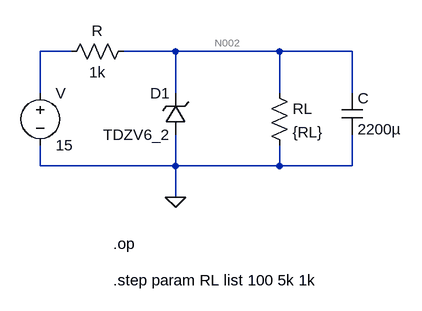
[diagram p0: schematic Draft3.asc]
Draft3.asc, the LTspice schematic file:
Version 4
SHEET 1 880 680
WIRE 112 64 64 64
WIRE 272 64 192 64
WIRE 432 64 272 64
WIRE 544 64 432 64
WIRE 64 128 64 64
WIRE 272 128 272 64
WIRE 432 128 432 64
WIRE 544 128 544 64
WIRE 64 240 64 208
WIRE 272 240 272 192
WIRE 272 240 64 240
WIRE 432 240 432 208
WIRE 432 240 272 240
WIRE 544 240 544 192
WIRE 544 240 432 240
WIRE 272 288 272 240
FLAG 272 288 0
SYMBOL voltage 64 112 R0
SYMATTR InstName V
SYMATTR Value 15
SYMBOL res 208 48 R90
WINDOW 0 0 56 VBottom 2
WINDOW 3 32 56 VTop 2
SYMATTR InstName R
SYMATTR Value 1k
SYMBOL res 416 112 R0
SYMATTR InstName RL
SYMATTR Value {RL}
SYMBOL cap 528 128 R0
SYMATTR InstName C
SYMATTR Value 2200µ
SYMBOL zener 288 192 R180
WINDOW 0 24 64 Left 2
WINDOW 3 24 0 Left 2
SYMATTR InstName D1
SYMATTR Value TDZV6_2
SYMATTR Description Diode
SYMATTR Type diode
TEXT 176 360 Left 2 !.op
TEXT 176 416 Left 2 !.step param RL list 100 5k 1k

The netlist it stands for:
* Draft3.asc
V N001 0 15
R N002 N001 1k
RL N002 0 {RL}
C N002 0 2200µ
D1 0 N002 TDZV6_2
.model D D
.lib standard.dio
.op
.step param RL list 100 5k 1k
.backanno
.end

* Results of the author's LTspice run, read from the files saved beside the schematic
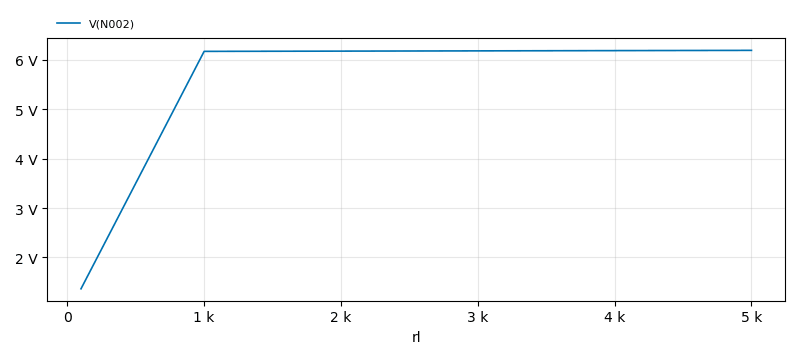
[diagram p1: Operating Point of Draft3.asc, plotted from the saved traces]
* Operating Point, 1 run:
*   V(N002): 1.364 V at rl=100 , 6.195 V at rl=5 k, min 1.364 V, max 6.195 V
* From the log:
*   Semiconductor Device Operating Points:
*                           --- Diodes ---
*   Name:      d1
*   Model:   tdzv6_2
*   Id:     -1.29e-11
*   Vd:     -1.36e+00
*   Req:     3.28e+10
*   CAP:     4.21e-10